# EasyEDA Pro project ProProject_Acho.epro, board PCB5
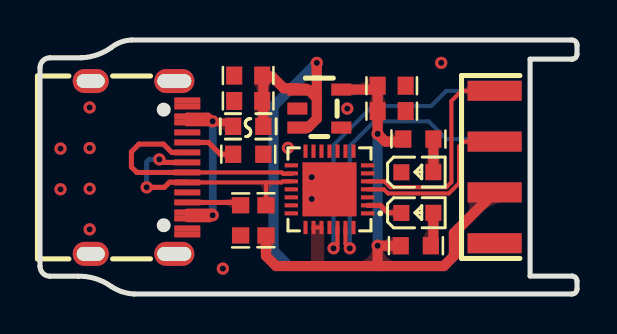
[diagram p4: board, top side]
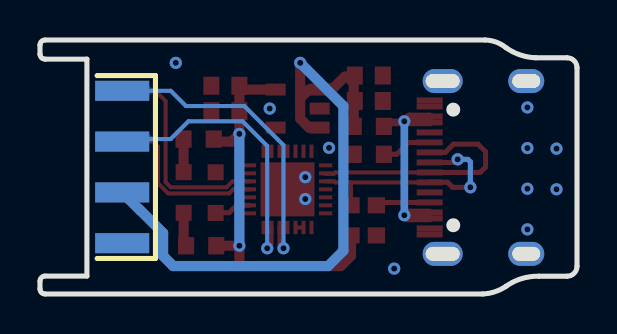
[diagram p5: board, bottom side, seen from below]

Outline 26.86 x 12.7 mm; copper layers: Top Layer, Bottom Layer. Coordinates in mm from the lower left corner of the outline.
Outline path: 0,11.31 0,1.39 arc(0.15,1.04) 0.5,0.89 1.91,0.89 arc(2.77,0.77) 3.56,0.38 arc(4.11,0.11) 4.71,0 26.6,0 arc(26.78,0.07) 26.86,0.25 26.86,0.64 arc(26.78,0.82) 26.6,0.9 24.51,0.9 24.51,11.74 26.6,11.74 arc(26.78,11.82) 26.86,12 26.86,12.45 arc(26.78,12.63) 26.6,12.7 4.6,12.7 arc(4.05,12.6) 3.56,12.32 arc(2.85,11.96) 2.07,11.81 0.5,11.81 arc(0.15,11.66) 0,11.31
Stack: Top Layer 0.035mm / Dielectric1 1.51mm FR4 er 4.5 / Bottom Layer 0.035mm

## Design rules (mm)
net USB_N: DP1
net USB_P: DP1
template: JLCPCB Capability(Two Layers Board)
spacing copperThickness1oz (default): track to track 0.102, other pairs 0.152 to 0.3
spacing copperThickness2oz: track to track 0.203, other pairs 0.152 to 0.3
track width copperThickness1oz (default): min 0.127, default 0.254, max 2.54
track width copperThickness2oz: min 0.203, default 0.254, max 2.54
differential pair differentialPair (default): width min 0.127, default 0.254, max 2.54; gap min 0.152, default 0.152
via viaSize (default): diameter min 0.5, default 0.61, max 10; hole min 0.3, default 0.305, max 6.3

## Placement (name value [footprint] x y rotation side)
C1  100nF  [C0603]  10.41 10.92 0 top
C2  10uF  [C0603]  10.41 9.65 0 top
C3  100nF  [C0603]  17.59 10.41 180 top
C4  10uF  [C0603]  17.59 9.14 180 top
H1  -  [HDR-EDGE-2x4P]  22.73 2.54 0 top
LED1  -  [LED_0603]  18.92 6.1 0 top
LED2  -  [LED_0603]  18.92 4.06 0 top
R1  10K  [R0603]  18.92 7.75 0 top
R2  5.1K  [R0603]  10.03 3.68 270 top
R3  5.1K  [R0603]  10.41 6.98 0 top
R4  10K  [R0603]  18.8 2.41 0 top
R5  10K  [R0603]  11.3 3.68 90 top
U1  RT9013-33GB  [SOT-23-5_L2.9-W1.6-P0.95-LS2.8-BR]  13.97 9.27 180 top
U2  CH549F  [QFN-28_L4.0-W4.0-P0.40-BL-EP]  14.48 5.23 90 top
U3  FUSE0603  [F0603]  10.41 8.38 0 top
USB1  KH-TYPE-C-16P  [USB-C-SMD_KH-TYPE-C-16P]  4.95 6.33 270 top

## Footprints (pads in the part's own frame, mm; a bottom-side part is the same pattern mirrored in y, then rotated)
C0603
  rect 0.8x0.9 smd: 1(-0.7,0) 2(0.7,0)
F0603
  rect 0.806x0.864 smd: 1(-0.753,0) 2(0.753,0)
HDR-EDGE-2x4P
  rect 2.7x1 smd: 1(0,7.62) 2(0,5.08) 3(0,2.54) 4(0,0)
  rect 2.7x1 smd far side: 5(0.017,7.62) 6(0.017,5.08) 7(0.017,2.54) 8(0.017,0)
LED_0603
  rect 0.8x0.8 smd: 1(-0.851,-0.01) 2(0.75,-0.005)
QFN-28_L4.0-W4.0-P0.40-BL-EP
  rect 0.2x0.665 smd: 1(-1.2,-1.907) 2(-0.8,-1.907) 3(-0.4,-1.907) 4(0,-1.907) 5(0.4,-1.907) 6(0.8,-1.907) 7(1.2,-1.907) 15(1.2,1.907) 16(0.8,1.907) 17(0.4,1.907) 18(0,1.907) 19(-0.4,1.907) 20(-0.8,1.907) 21(-1.2,1.907)
  rect 0.665x0.2 smd: 8(1.907,-1.2) 9(1.907,-0.8) 10(1.907,-0.4) 11(1.907,0) 12(1.907,0.4) 13(1.907,0.8) 14(1.907,1.2) 22(-1.907,1.2) 23(-1.907,0.8) 24(-1.907,0.4) 25(-1.907,0) 26(-1.907,-0.4) 27(-1.907,-0.8) 28(-1.907,-1.2)
  rect 2.7x2.7 smd: 29(0,0)
R0603
  rect 0.806x0.864 smd: 1(-0.753,0) 2(0.753,0)
SOT-23-5_L2.9-W1.6-P0.95-LS2.8-BR
  rect 1x0.6 smd: 1(1.1,-0.95) 2(1.1,0) 3(1.1,0.95) 4(-1.1,0.95) 5(-1.1,-0.95)
USB-C-SMD_KH-TYPE-C-16P
  oval 1.2x2 hole 0.7x1.7: 1(-4.32,1.765) 2(4.32,1.765)
  oval 1.2x1.8 hole 0.7x1.4: 3(-4.32,-2.415) 4(4.32,-2.415)
  rect 0.3x1.3 smd: A1(-3.35,2.415) A4(-2.55,2.415) A5(-1.25,2.415) A6(-0.25,2.415) A7(0.25,2.415) A8(1.25,2.415) A9(2.55,2.415) A12(3.35,2.415) B1(3.05,2.415) B4(2.25,2.415) B5(1.75,2.415) B6(0.75,2.415) B7(-0.75,2.415) B8(-1.75,2.415) B9(-2.25,2.415) B12(-3.05,2.415)

## Nets
+3.3V: C3.2 C4.2 H1.3 R1.1 R4.1 R5.1 U1.5 U2.23 U2.24
+5V: C1.2 C2.2 H1.7 U1.1 U1.3 U3.2
GND: C1.1 C2.1 C3.1 C4.1 H1.4 H1.8 LED1.1 R2.2 R3.2 U1.2 U2.29 USB1.1 USB1.2 USB1.3 USB1.4 USB1.A1 USB1.A12 USB1.B1 USB1.B12
VBUS: U3.1 USB1.A4 USB1.A9 USB1.B4 USB1.B9
DAP_LED: LED2.1 U2.2
DAP_SWCLK: H1.6 U2.27
DAP_SWDIO: H1.5 U2.26
DAP_UART_RX: H1.2 U2.4
DAP_UART_TX: H1.1 U2.5
USB_N: U2.16 USB1.A7 USB1.B7
USB_P: R5.2 U2.17 USB1.A6 USB1.B6
$1N720: LED1.2 R1.2
$1N1198: R2.1 USB1.B5
$1N1200: R3.1 USB1.A5
$1N2098: LED2.2 R4.2

Pads without a net: U1 4; U2 1 3 6 7 8 9 10 11 12 13 14 15 18 19 20 21 22 25 28; USB1 A8 B8

## Via types
v1: diameter 0.61, hole 0.305, Top Layer to Bottom Layer, 21 vias

## Routing (per net, layer and track width the routed paths; a pad name or vN(x,y) marks a point on that pad's centre or on a via; arc(x,y) is an arc through that point)
+3.3V: length 28.8
  Top Layer w0.203: 13.68,3.33 14.08,3.33
  Top Layer w0.508: H1.3 20.7,3.05 20.7,1.91 20.19,1.4 16.93,1.4 ; R4.1 v1(16.89,2.41) 16.89,1.44 16.93,1.4 ; R5.1 11.3,1.91 11.81,1.4 16.93,1.4 ; U1.5 16.69,10.22 C3.2 C4.2 v1(16.89,8.01) 17.27,7.62 18.17,7.62
  Bottom Layer w0.508: v1(16.89,2.41) v1(16.89,8.01)
+5V: length 33.6
  Top Layer w0.508: 11.17,10.87 11.61,10.87 12.19,10.29 12.8,10.29 U1.1 13.41,10.22 13.84,9.79 ; 11.17,10.87 C1.2 ; 11.17,10.87 11.17,9.65 ; 13.84,9.79 13.84,8.76 13.4,8.32 U1.3 ; 13.84,9.79 v1(13.84,11.56) ; 11.17,9.65 C2.2 ; 11.17,9.65 U3.2
  Bottom Layer w0.508: v1(13.84,11.56) 11.68,9.4 11.68,2.16 12.45,1.4 20.19,1.4 20.7,1.91 20.7,3.05 21.84,4.19 21.86,4.19 H1.7
GND:
  vias: v1(1.03,7.27) v1(1.03,5.24) v1(2.48,9.33) v1(2.48,7.3) v1(2.48,5.26) v1(2.48,3.23) v1(9.14,1.27) v1(12.4,7.31) v1(13.59,5.84) v1(13.59,4.75) v1(15.37,9.27) v1(20.07,11.56)
VBUS: length 11.5
  Top Layer w0.381: U3.1 9.46,8.58 USB1.B9 USB1.A4 8.39,8.88 v1(8.64,8.64) ; USB1.A9 8.48,3.78 v1(8.64,3.94) 8.64,4.08 USB1.B4
  Bottom Layer w0.381: v1(8.64,3.94) v1(8.64,8.64)
DAP_LED: length 1.8
  Top Layer w0.254: LED2.1 18.06,4.06 17.4,4.06 17.03,4.43 U2.2
DAP_SWCLK: length 14.4
  Top Layer w0.203: v1(15.49,2.29) 15.28,2.5 U2.27
  Bottom Layer w0.203: H1.6 22.62,7.75 20.32,7.75 19.43,8.64 16.73,8.64 15.49,7.4 v1(15.49,2.29)
DAP_SWDIO: length 15.5
  Top Layer w0.203: v1(14.68,2.29) 14.88,2.48 U2.26
  Bottom Layer w0.203: H1.5 20.32,10.16 19.56,9.4 16.64,9.4 14.68,7.44 v1(14.68,2.29)
DAP_UART_RX: length 8.6
  Top Layer w0.203: U2.4 17.2,5.23 17.4,5.03 20.45,5.03 20.95,5.54 20.95,7.37 21.21,7.62 H1.2
DAP_UART_TX: length 10.9
  Top Layer w0.203: U2.5 17.23,5.63 17.53,5.33 20.32,5.33 20.57,5.59 20.57,9.65 21.08,10.16 H1.1
USB_N: length 12.1
  Top Layer w0.203: USB1.A7 12.09,6.08 12.16,6.01 12.6,6.01
  Top Layer w0.254: USB1.A7 4.84,6.08 4.57,6.35 4.57,7.11 4.95,7.49 6.18,7.49 6.59,7.08 USB1.B7
USB_P: length 11.9
  Top Layer w0.203: U2.17 12.14,5.63 12.08,5.58 11.33,5.58 ; 11.33,5.58 11.3,5.55 R5.2 ; 11.33,5.58 USB1.B6
  Top Layer w0.254: USB1.A6 6.12,6.58 v1(5.97,6.73) ; v1(5.33,5.33) 6.22,5.33 6.48,5.59 7.36,5.59 USB1.B6
  Bottom Layer w0.254: v1(5.97,6.73) 5.46,6.73 5.33,6.6 v1(5.33,5.33)
$1N720: length 1.7
  Top Layer w0.508: 19.68,7.62 19.68,5.97 19.67,5.96
$1N1198: length 2.7
  Top Layer w0.254: R2.1 9.89,4.58 USB1.B5
$1N1200: length 2.5
  Top Layer w0.254: R3.1 9.02,6.98 8.42,7.58 USB1.A5
$1N2098: length 1.8
  Top Layer w0.508: 19.67,4.19 19.67,2.54 R4.2

## Copper pours and planes (outline as drawn; the poured copper is in the pictures)
+3.3V on Top Layer: 13.55,3.33 14.22,3.33 14.22,1.4 13.55,1.4
GND on Top Layer: -0.38,13.84 24,13.84 24,-1.02 -0.38,-1.02
GND on Bottom Layer: -0.38,13.84 24,13.84 24,-1.02 -0.38,-1.02

Small or netless copper shapes (teardrops, artwork), in the pictures only: 53 on Top Layer, 8 on Bottom Layer
